# Altium schematic sheet Top-level.SchDoc: Top-Level
size A3; CompanyName: Novelda AS; Organization: Novelda AS; Address1: Gjerdrums vei 8; Address2: NO-0484 Oslo; Address3: Norway; Revision: 1.A; SheetNumber: 1; SheetTotal: 3; Classification: Restricted; Size: A3; Project: X4M01; ProjectName: Prosject Name
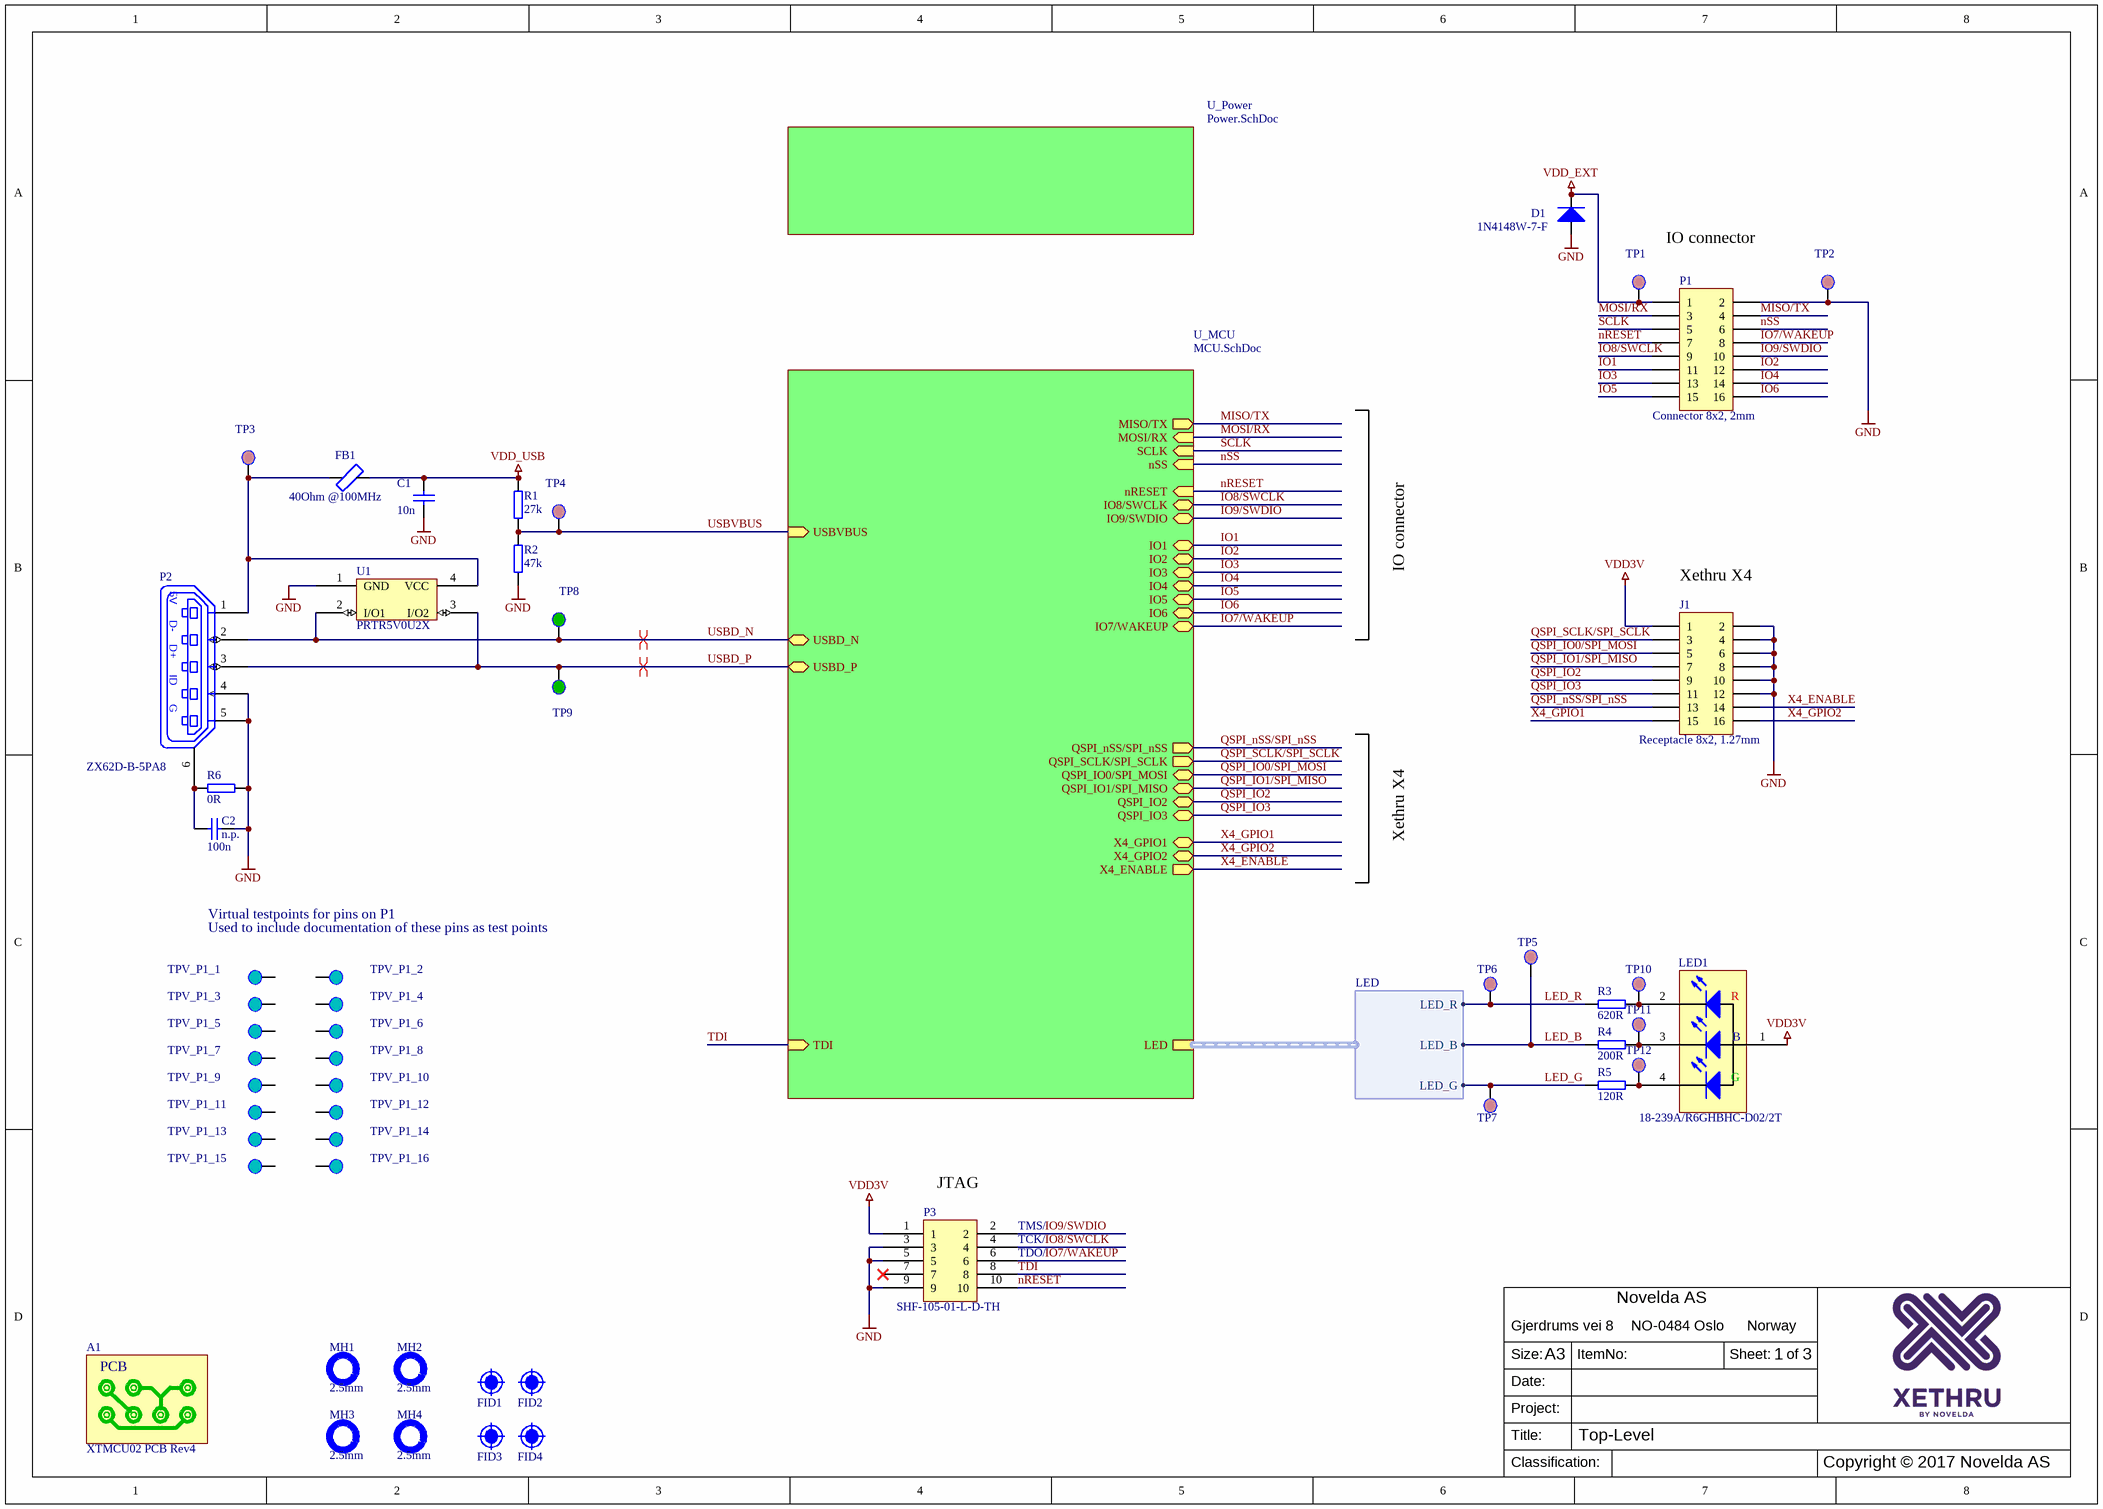
[diagram p0: Top-level.SchDoc]

## Parts
A1  XTMCU02 PCB Rev4  (mechanical)
C1  10n  [0402-CAPACITOR-NONPOL]
C2  100n  Notes: n.p.  [0603-CAPACITOR-NONPOL]
D1  1N4148W-7-F  [200048]
FB1  40Ohm @100MHz  [200017]
FID1  Fiducial  [ALTIUM-0005]  (value not drawn)  (no BOM)
FID2  Fiducial  [ALTIUM-0005]  (value not drawn)  (no BOM)
FID3  Fiducial  [ALTIUM-0005]  (value not drawn)  (no BOM)
FID4  Fiducial  [ALTIUM-0005]  (value not drawn)  (no BOM)
J1  Receptacle 8x2, 1.27mm  [200283]
LED1  18-239A/R6GHBHC-D02/2T  [200018]
MH1  2.5mm  [ALTIUM-0003]  (no BOM)
MH2  2.5mm  [ALTIUM-0003]  (no BOM)
MH3  2.5mm  [ALTIUM-0003]  (no BOM)
MH4  2.5mm  [ALTIUM-0003]  (no BOM)
P1  Connector 8x2, 2mm  [200019]
P2  ZX62D-B-5PA8  [200020]
P3  SHF-105-01-L-D-TH  [200073]
R1  27k  [0402-RESISTOR]
R2  47k  [0402-RESISTOR]
R3  620R  [0402-RESISTOR]
R4  200R  [0402-RESISTOR]
R5  120R  [0402-RESISTOR]
R6  0R  [0603-RESISTOR]
TP1  TP-MDA  [ALTIUM-0001]  (value not drawn)  (no BOM)
TP2  TP-MDA  [ALTIUM-0001]  (value not drawn)  (no BOM)
TP3  TP-MDA  [ALTIUM-0001]  (value not drawn)  (no BOM)
TP4  TP-MDA  [ALTIUM-0001]  (value not drawn)  (no BOM)
TP5  TP-MDA  [ALTIUM-0001]  (value not drawn)  (no BOM)
TP6  TP-MDA  [ALTIUM-0001]  (value not drawn)  (no BOM)
TP7  TP-MDA  [ALTIUM-0001]  (value not drawn)  (no BOM)
TP8  TP  [ALTIUM-0001]  (value not drawn)  (no BOM)
TP9  TP  [ALTIUM-0001]  (value not drawn)  (no BOM)
TP10  TP-MDA  [ALTIUM-0001]  (value not drawn)  (no BOM)
TP11  TP-MDA  [ALTIUM-0001]  (value not drawn)  (no BOM)
TP12  TP-MDA  [ALTIUM-0001]  (value not drawn)  (no BOM)
TPV_P1_1  TPV  (value not drawn)  (graphical)
TPV_P1_2  TPV  (value not drawn)  (graphical)
TPV_P1_3  TPV  (value not drawn)  (graphical)
TPV_P1_4  TPV  (value not drawn)  (graphical)
TPV_P1_5  TPV  (value not drawn)  (graphical)
TPV_P1_6  TPV  (value not drawn)  (graphical)
TPV_P1_7  TPV  (value not drawn)  (graphical)
TPV_P1_8  TPV  (value not drawn)  (graphical)
TPV_P1_9  TPV  (value not drawn)  (graphical)
TPV_P1_10  TPV  (value not drawn)  (graphical)
TPV_P1_11  TPV  (value not drawn)  (graphical)
TPV_P1_12  TPV  (value not drawn)  (graphical)
TPV_P1_13  TPV  (value not drawn)  (graphical)
TPV_P1_14  TPV  (value not drawn)  (graphical)
TPV_P1_15  TPV  (value not drawn)  (graphical)
TPV_P1_16  TPV  (value not drawn)  (graphical)
U1  PRTR5V0U2X  [200051]

## Sub-sheets
U_MCU = MCU.SchDoc: nRESET (in), IO7/WAKEUP (bidir), IO9/SWDIO (bidir), IO8/SWCLK (bidir), IO2 (bidir), IO1 (bidir), IO4 (bidir), IO3 (bidir), USBD_P (bidir), USBD_N (bidir), IO5 (bidir), IO6 (bidir), USBVBUS (in), MISO/TX (out), MOSI/RX (in), SCLK (in), nSS (in), LED (harness LED), QSPI_nSS/SPI_nSS (out), QSPI_IO1/SPI_MISO (bidir), QSPI_IO0/SPI_MOSI (bidir), QSPI_IO3 (bidir), QSPI_SCLK/SPI_SCLK (out), X4_GPIO2 (bidir), X4_GPIO1 (bidir), X4_ENABLE (out), QSPI_IO2 (bidir), TDI (in)
U_Power = Power.SchDoc: no entries

## Harnesses
LED: LED_R, LED_B, LED_G

## Nets
GND: C1.1 C2.2 D1.A J1.2 J1.4 J1.6 J1.8 J1.10 J1.12 P1.2 P2.4(ID) P2.5(G) P3.3 P3.5 P3.9 R2.1 R6.2 TP2.1 U1.1(GND)
VDD3V: J1.1 LED1.1(A) P3.1
VDD_EXT: D1.K P1.1 TP1.1
VDD_USB: C1.2 FB1.1 R1.1
IO1: P1.11 ; sheet U_MCU/IO1
IO2: P1.12 ; sheet U_MCU/IO2
IO3: P1.13 ; sheet U_MCU/IO3
IO4: P1.14 ; sheet U_MCU/IO4
IO5: P1.15 ; sheet U_MCU/IO5
IO6: P1.16 ; sheet U_MCU/IO6
IO7/WAKEUP: P1.8 P3.6 ; sheet U_MCU/IO7/WAKEUP
IO8/SWCLK: P1.9 P3.4 ; sheet U_MCU/IO8/SWCLK
IO9/SWDIO: P1.10 P3.2 ; sheet U_MCU/IO9/SWDIO
LED_B: R4.2 TP5.1 ; sheet U_MCU/LED.LED_B
LED_G: R5.2 TP7.1 ; sheet U_MCU/LED.LED_G
LED_R: R3.2 TP6.1 ; sheet U_MCU/LED.LED_R
MISO/TX: P1.4 ; sheet U_MCU/MISO/TX
MOSI/RX: P1.3 ; sheet U_MCU/MOSI/RX
nRESET: P1.7 P3.10 ; sheet U_MCU/nRESET
nSS: P1.6 ; sheet U_MCU/nSS
QSPI_IO0/SPI_MOSI: J1.5 ; sheet U_MCU/QSPI_IO0/SPI_MOSI
QSPI_IO1/SPI_MISO: J1.7 ; sheet U_MCU/QSPI_IO1/SPI_MISO
QSPI_IO2: J1.9 ; sheet U_MCU/QSPI_IO2
QSPI_IO3: J1.11 ; sheet U_MCU/QSPI_IO3
QSPI_nSS/SPI_nSS: J1.13 ; sheet U_MCU/QSPI_nSS/SPI_nSS
QSPI_SCLK/SPI_SCLK: J1.3 ; sheet U_MCU/QSPI_SCLK/SPI_SCLK
SCLK: P1.5 ; sheet U_MCU/SCLK
TDI: P3.8 ; sheet U_MCU/TDI
USBD_N: P2.2(D-) TP8.1 U1.2(I/O1) ; sheet U_MCU/USBD_N
USBD_P: P2.3(D+) TP9.1 U1.3(I/O2) ; sheet U_MCU/USBD_P
USBVBUS: R1.2 R2.2 TP4.1 ; sheet U_MCU/USBVBUS
X4_ENABLE: J1.14 ; sheet U_MCU/X4_ENABLE
X4_GPIO1: J1.15 ; sheet U_MCU/X4_GPIO1
X4_GPIO2: J1.16 ; sheet U_MCU/X4_GPIO2
NetC2_1: C2.1 P2.6(SH) R6.1
NetFB1_2: FB1.2 P2.1(5V) TP3.1 U1.4(VCC)
NetLED1_2: LED1.2(K_RED) R3.1 TP10.1
NetLED1_3: LED1.3(K_BLUE) R4.1 TP11.1
NetLED1_4: LED1.4(K_GREEN) R5.1 TP12.1

Not connected (* = marked no-connect by the designer): P3 7*; TPV_P1_1 1; TPV_P1_2 1; TPV_P1_3 1; TPV_P1_4 1; TPV_P1_5 1; TPV_P1_6 1; TPV_P1_7 1; TPV_P1_8 1; TPV_P1_9 1; TPV_P1_10 1; TPV_P1_11 1; TPV_P1_12 1; TPV_P1_13 1; TPV_P1_14 1; TPV_P1_15 1; TPV_P1_16 1

## Layout directives
differential pair: USBD_N, USBD_P

## Notes on the sheet
- IO connector
- (near J1) Xethru X4
- Xethru X4
- Virtual testpoints for pins on P1
- Used to include documentation of these pins as test points
- (near P3) JTAG
- (near P3) TMS/
- (near P3) TCK/
- (near P3) TDO/
- Size:
- Date:
- ItemNo:
- Sheet:
- of
- Title:
- Project:
- Classification:
- Copyright © 2017 Novelda AS
- (in symbol 200018) R; B; G

## Library data of the parts
A1 = 290052-004: Manufacturer: Novelda; Component Status: New; ItemNo: 290052-004; Value: XTMCU02 PCB Rev4; Component Category: PCB; MPN: 290052-004; ClassName: -; Notes: -
C1 = 200005: CAPACITOR, 10n, 0402, 20%, 25V, X7R; ItemNo: 200005; Component Status: Active; Value: 10n; Component Category: Capacitor; Manufacturer: --; Supplier: Farnell Norge; SupplierCatNo: 1758924
C2 = 200152: CAPACITOR, 100n, 0603, 10%, 16V, X7R; ItemNo: 200152; Component Status: New; Value: 100n; Component Category: Capacitor; Manufacturer: --; Supplier: Farnell Norge; SupplierCatNo: 1759016; ClassName: -
D1 = 200164: DIODE, 1N4148W-7-F, SWITCH, 300MA, 100V, SOD123; ItemNo: 200164; Component Status: New; Value: 1N4148W-7-F; Component Category: Diode; Manufacturer: --; ClassName: -; Notes: -; Supplier: Digi-Key; SupplierCatNo: 1N4148W-FDICT-ND
FB1 = 200017: FERRITE 1.5A 40 OHM 0805 SMD; Manufacturer: Laird-Signal Integrity Product; MPN: MI0805K400R-10; Component Status: Active; Component Category: Inductor; ItemNo: 200017; Value: 40Ohm @100MHz; Supplier: Digi-Key; SupplierCatNo: 240-2389-1-ND
FID1-FID4 = ALTIUM-0005: Fiduial 1.1mm; Component Status: Active; Component Category: Misc; ItemNo: ALTIUM-0005; Value: Fiducial; ClassName: Fiducial
J1 = 200283: CONNECTOR, RECEPTACLE, 1.27MM, THT, 8WAY, 2ROW; Manufacturer: Harwin; MPN: M50-3000845; Component Status: New; ItemNo: 200283; Value: Receptacle 8x2, 1.27mm; Component Category: Connector; ClassName: -; Notes: -; Supplier: Digi-Key; SupplierCatNo: 952-1367-5-ND
LED1 = 200018: LED RGB, 0404, Everlight 18-239A/R6GHBHC-D02/2T; Int_Manufacturer: Lumex; Component Status: New; ItemNo: 200018; Value: 18-239A/R6GHBHC-D02/2T; Component Category: LED; Manufacturer: Everlight; MPN: 18-239A/R6GHBHC-D02/2T; Supplier: Digi-Key; SupplierCatNo: 67-2125-1-ND
MH1-MH4 = ALTIUM-0003: MOUNTING-HOLE-2.5mm, WITHOUT NET; Component Status: Active; Component Category: Misc; ItemNo: ALTIUM-0003; Value: 2.5mm
P1 = 200019: BOARD-BOARD CONNECTOR HEADER, 8WAY, 2ROW, 2MM PITCH; Manufacturer: PINREX; MPN: 220-92-08GB22; Component Status: Active; ItemNo: 200019; Value: Connector 8x2, 2mm; Component Category: Connector; Supplier: Farnell Norge; SupplierCatNo: 1668543
P2 = 200020: CONNECTOR, MICRO USB, RECEPTACLE, 5WAY; Manufacturer: Hirose; Component Status: Active; ItemNo: 200020; Value: ZX62D-B-5PA8; Component Category: Connector; MPN: ZX62D-B-5PA8; Supplier: Farnell Norge; SupplierCatNo: 2300438
P3 = 200073: CONNECTOR, 1.27MM, THRU HOLE, 2X5WAY; Manufacturer: Samtec; Component Status: Active; ItemNo: 200073; Value: SHF-105-01-L-D-TH; Component Category: Connector; MPN: SHF-105-01-L-D-TH; ClassName: -; Notes: -; Supplier: Farnell Norge; SupplierCatNo: 2308450
R1 = 200062: RESISTOR, 27k, 0402, 1%, 63mW; ItemNo: 200062; Component Status: Active; Value: 27k; Component Category: Resistor; Manufacturer: --; Supplier: Farnell Norge; SupplierCatNo: 2331498
R2 = 200063: RESISTOR, 47k, 0402, 1%, 63mW; ItemNo: 200063; Component Status: Active; Value: 47k; Component Category: Resistor; Manufacturer: --; Supplier: Farnell Norge; SupplierCatNo: 1469719
R3 = 200032: RESISTOR, 620R, 0402, 1%, 63mW; ItemNo: 200032; Component Status: Active; Value: 620R; Component Category: Resistor; Manufacturer: --; Supplier: Farnell Norge; SupplierCatNo: 2331552
R4 = 200031: RESISTOR, 200R, 0402, 1%, 63mW; ItemNo: 200031; Component Status: Active; Value: 200R; Component Category: Resistor; Manufacturer: --; Supplier: Farnell Norge; SupplierCatNo: 2331484
R5 = 200030: RESISTOR, 120R, 0402, 1%, 63mW; ItemNo: 200030; Component Status: Active; Value: 120R; Component Category: Resistor; Manufacturer: --; Supplier: Farnell Norge; SupplierCatNo: 2331452
R6 = 200305: RESISTOR, 0R, 0603, 1%, 100mW; ItemNo: 200305; Component Status: New; Value: 0R; Component Category: Resistor; Manufacturer: --; Supplier: Farnell Norge; SupplierCatNo: 2309111; ClassName: -; Notes: -
TP1 TP2 TP4-TP7 TP10-TP12 = ALTIUM-0023: TESTPOINT FOR MDA-TEST, 1mm ROUND, SMD; Component Status: Active; Component Category: Misc; TP_Type: MDA; ItemNo: ALTIUM-0023; Value: TP-MDA; ClassName: MDA-Testpoint
TP3 = ALTIUM-0023: TESTPOINT FOR MDA-TEST, 1mm ROUND, SMD; Component Status: Active; Component Category: Misc; TP_Type: Testjig,MDA; TP_LegalValueRange: 4.5V - 5.5V; TP_Notes: USB supply voltage; ItemNo: ALTIUM-0023; Value: TP-MDA; ClassName: MDA-Testpoint
TP8 = ALTIUM-0001: TESTPOINT, 1mm ROUND, SMD; Component Status: Active; Component Category: Misc; TP_Type: Testjig; TP_Notes: USB Data-; ItemNo: ALTIUM-0001; Value: TP; ClassName: Testpoint
TP9 = ALTIUM-0001: TESTPOINT, 1mm ROUND, SMD; Component Status: Active; Component Category: Misc; TP_Type: Testjig; TP_Notes: USB Data+; ItemNo: ALTIUM-0001; Value: TP; ClassName: Testpoint
TPV_P1_1 = ALTIUM-0007: TESTPOINT, Virtual, Only on schematic, Used when actual testpoint is other component pins.; Component Status: Active; Component Category: Misc; TP_Type: Testjig; TP_LegalValueRange: 4.5V - 5.5V; TP_Notes: External voltage input; ItemNo: ALTIUM-0007; Value: TPV; ClassName: Testpoint
TPV_P1_2 = ALTIUM-0007: TESTPOINT, Virtual, Only on schematic, Used when actual testpoint is other component pins.; Component Status: Active; Component Category: Misc; TP_Type: Testjig; TP_LegalValueRange: 0V; TP_Notes: GND; ItemNo: ALTIUM-0007; Value: TPV; ClassName: Testpoint
TPV_P1_3 = ALTIUM-0007: TESTPOINT, Virtual, Only on schematic, Used when actual testpoint is other component pins.; Component Status: Active; Component Category: Misc; TP_Type: Testjig; TP_Notes: SPI MOSI/UART RX; ItemNo: ALTIUM-0007; Value: TPV; ClassName: Testpoint
TPV_P1_4 = ALTIUM-0007: TESTPOINT, Virtual, Only on schematic, Used when actual testpoint is other component pins.; Component Status: Active; Component Category: Misc; TP_Type: Testjig; TP_Notes: SPI MISO/UART TX; ItemNo: ALTIUM-0007; Value: TPV; ClassName: Testpoint
TPV_P1_5 = ALTIUM-0007: TESTPOINT, Virtual, Only on schematic, Used when actual testpoint is other component pins.; Component Status: Active; Component Category: Misc; TP_Type: Testjig; TP_Notes: SPI SCLK; ItemNo: ALTIUM-0007; Value: TPV; ClassName: Testpoint
TPV_P1_6 = ALTIUM-0007: TESTPOINT, Virtual, Only on schematic, Used when actual testpoint is other component pins.; Component Status: Active; Component Category: Misc; Notes: Active Low; TP_Type: Testjig; TP_Notes: SPI NSS; ItemNo: ALTIUM-0007; Value: TPV; ClassName: Testpoint
TPV_P1_7 = ALTIUM-0007: TESTPOINT, Virtual, Only on schematic, Used when actual testpoint is other component pins.; Component Status: Active; Component Category: Misc; Notes: Use for programming; TP_Type: Testjig; TP_Notes: MCU nRESET; ItemNo: ALTIUM-0007; Value: TPV; ClassName: Testpoint
TPV_P1_8 = ALTIUM-0007: TESTPOINT, Virtual, Only on schematic, Used when actual testpoint is other component pins.; Component Status: Active; Component Category: Misc; TP_Type: Testjig; TP_Notes: IO7/WAKEUP; ItemNo: ALTIUM-0007; Value: TPV; ClassName: Testpoint
TPV_P1_9 = ALTIUM-0007: TESTPOINT, Virtual, Only on schematic, Used when actual testpoint is other component pins.; Component Status: Active; Component Category: Misc; TP_Type: Testjig; TP_Notes: IO8/SWCLK; ItemNo: ALTIUM-0007; Value: TPV; ClassName: Testpoint
TPV_P1_10 = ALTIUM-0007: TESTPOINT, Virtual, Only on schematic, Used when actual testpoint is other component pins.; Component Status: Active; Component Category: Misc; TP_Type: Testjig; TP_Notes: IO9/SWDIO; ItemNo: ALTIUM-0007; Value: TPV; ClassName: Testpoint
TPV_P1_11 = ALTIUM-0007: TESTPOINT, Virtual, Only on schematic, Used when actual testpoint is other component pins.; Component Status: Active; Component Category: Misc; TP_Type: Testjig; TP_Notes: IO1; ItemNo: ALTIUM-0007; Value: TPV; ClassName: Testpoint
TPV_P1_12 = ALTIUM-0007: TESTPOINT, Virtual, Only on schematic, Used when actual testpoint is other component pins.; Component Status: Active; Component Category: Misc; TP_Type: Testjig; TP_Notes: IO2; ItemNo: ALTIUM-0007; Value: TPV; ClassName: Testpoint
TPV_P1_13 = ALTIUM-0007: TESTPOINT, Virtual, Only on schematic, Used when actual testpoint is other component pins.; Component Status: Active; Component Category: Misc; TP_Type: Testjig; TP_Notes: IO3; ItemNo: ALTIUM-0007; Value: TPV; ClassName: Testpoint
TPV_P1_14 = ALTIUM-0007: TESTPOINT, Virtual, Only on schematic, Used when actual testpoint is other component pins.; Component Status: Active; Component Category: Misc; TP_Type: Testjig; TP_Notes: IO4; ItemNo: ALTIUM-0007; Value: TPV; ClassName: Testpoint
TPV_P1_15 = ALTIUM-0007: TESTPOINT, Virtual, Only on schematic, Used when actual testpoint is other component pins.; Component Status: Active; Component Category: Misc; TP_Type: Testjig; TP_Notes: IO5; ItemNo: ALTIUM-0007; Value: TPV; ClassName: Testpoint
TPV_P1_16 = ALTIUM-0007: TESTPOINT, Virtual, Only on schematic, Used when actual testpoint is other component pins.; Component Status: Active; Component Category: Misc; TP_Type: Testjig; TP_Notes: IO6; ItemNo: ALTIUM-0007; Value: TPV; ClassName: Testpoint
U1 = 200051: DIODE PROTECTION, TVS, DUAL; Manufacturer: NXP; Component Status: Active; ItemNo: 200051; Value: PRTR5V0U2X; Component Category: Diode; MPN: PRTR5V0U2X; Supplier: Farnell Norge; SupplierCatNo: 2371119